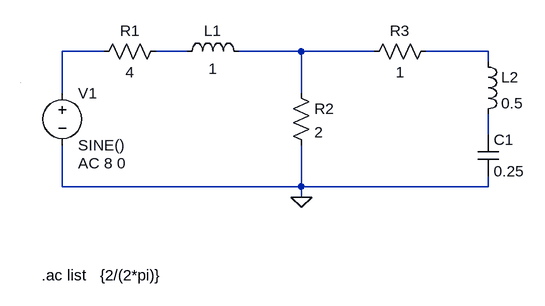
[diagram p0: schematic 04 AC Analysis.asc]
04 AC Analysis.asc, the LTspice schematic file:
Version 4
SHEET 1 880 680
WIRE 128 -48 64 -48
WIRE 256 -48 208 -48
WIRE 432 -48 336 -48
WIRE 544 -48 432 -48
WIRE 720 -48 624 -48
WIRE 720 -32 720 -48
WIRE 64 16 64 -48
WIRE 432 16 432 -48
WIRE 720 80 720 48
WIRE 64 160 64 96
WIRE 432 160 432 96
WIRE 432 160 64 160
WIRE 720 160 720 144
WIRE 720 160 432 160
WIRE 432 176 432 160
WIRE 0 0 0 0
FLAG 432 176 0
SYMBOL voltage 64 0 R0
WINDOW 123 24 124 Left 2
WINDOW 39 0 0 Left 0
SYMATTR Value2 AC 8 0
SYMATTR InstName V1
SYMATTR Value SINE()
SYMBOL res 224 -64 R90
WINDOW 0 0 56 VBottom 2
WINDOW 3 32 56 VTop 2
SYMATTR InstName R1
SYMATTR Value 4
SYMBOL ind 240 -32 R270
WINDOW 0 32 56 VTop 2
WINDOW 3 5 56 VBottom 2
SYMATTR InstName L1
SYMATTR Value 1
SYMBOL res 416 0 R0
SYMATTR InstName R2
SYMATTR Value 2
SYMBOL res 640 -64 R90
WINDOW 0 0 56 VBottom 2
WINDOW 3 32 56 VTop 2
SYMATTR InstName R3
SYMATTR Value 1
SYMBOL ind 704 -48 R0
SYMATTR InstName L2
SYMATTR Value 0.5
SYMBOL cap 704 80 R0
SYMATTR InstName C1
SYMATTR Value 0.25
TEXT 32 296 Left 2 !.ac list   {2/(2*pi)}

The netlist it stands for:
* 04 AC Analysis.asc
V1 N001 0 SINE() AC 8 0
R1 N002 N001 4
L1 N002 N003 1
R2 N003 0 2
R3 N004 N003 1
L2 N004 N005 0.5
C1 N005 0 0.25
.ac list   {2/(2*pi)}
.backanno
.end